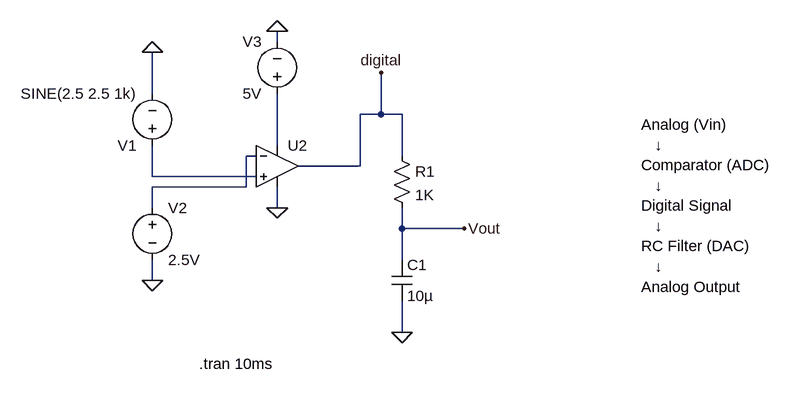
[diagram p0: schematic PartD_FullSystemIntegration.asc]
PartD_FullSystemIntegration.asc, the LTspice schematic file:
Version 4.1
SHEET 1 1144 680
WIRE 368 -16 368 -32
WIRE 176 64 176 0
WIRE 528 96 528 32
WIRE 528 96 496 96
WIRE 560 96 528 96
WIRE 368 144 368 64
WIRE 336 160 320 160
WIRE 560 160 560 96
WIRE 496 176 496 96
WIRE 496 176 400 176
WIRE 176 192 176 144
WIRE 336 192 176 192
WIRE 320 208 320 160
WIRE 320 208 176 208
WIRE 176 240 176 208
WIRE 368 240 368 208
WIRE 560 272 560 240
WIRE 656 272 560 272
WIRE 560 320 560 272
WIRE 176 352 176 320
WIRE 560 432 560 384
FLAG 560 432 0
FLAG 176 352 0
FLAG 176 0 0
FLAG 368 240 0
FLAG 368 -32 0
FLAG 528 32 digital
FLAG 656 272 Vout
SYMBOL voltage 176 160 R180
WINDOW 123 0 0 Left 0
WINDOW 39 0 0 Left 0
SYMATTR InstName V1
SYMATTR Value SINE(2.5 2.5 1k)
SYMBOL voltage 176 224 R0
WINDOW 123 0 0 Left 0
WINDOW 39 0 0 Left 0
SYMATTR InstName V2
SYMATTR Value 2.5V
SYMBOL cap 544 320 R0
SYMATTR InstName C1
SYMATTR Value 10µ
SYMBOL res 544 144 R0
SYMATTR InstName R1
SYMATTR Value 1K
SYMBOL OpAmps\\UniversalOpAmp2 368 176 R0
SYMATTR InstName U2
SYMBOL voltage 368 80 R180
WINDOW 0 24 96 Left 2
WINDOW 3 24 16 Left 2
SYMATTR InstName V3
SYMATTR Value 5V
TEXT 248 480 Left 2 !.tran 10ms
TEXT 928 112 Left 2 !Analog (Vin)\n   ↓\nComparator (ADC)\n   ↓\nDigital Signal\n   ↓\nRC Filter (DAC)\n   ↓\nAnalog Output

The netlist it stands for:
* PartD_FullSystemIntegration.asc
V1 N003 0 SINE(2.5 2.5 1k)
V2 N002 0 2.5V
C1 Vout 0 10µ
R1 digital Vout 1K
X§U2 N003 N002 N001 0 digital level2 Avol=1Meg GBW=10Meg Slew=10Meg Ilimit=25m Rail=0 Vos=0 En=0 Enk=0 In=0 Ink=0 Rin=500Meg  ; pins In+ In- V+ V- OUT
V3 N001 0 5V
.tran 10ms
Analog (Vin)
   ↓
Comparator (ADC)
   ↓
Digital Signal
   ↓
RC Filter (DAC)
   ↓
Analog Output
.lib UniversalOpAmp2.lib
.backanno
.end